# EAGLE design sensor_board (EAGLE 7.2.0)
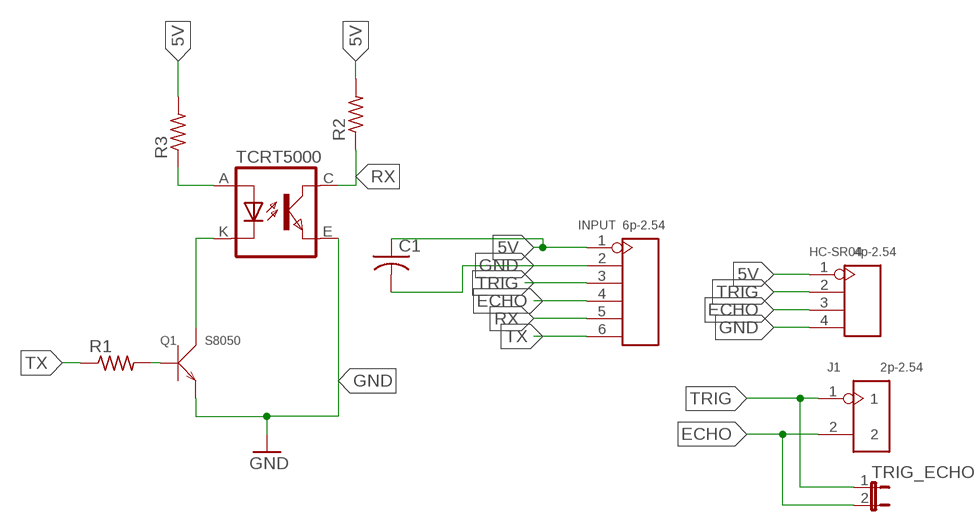
[diagram p0: schematic, sheet 1]

## Parts
C1  C-USC1206  [C1206]
HC-SR04  4p-2.54  DIP-BLACK-FEMALE-HEADER-VERT(4P-2.54)  [H4-2.54]
INPUT  6p-2.54  DIP-BLACK-FEMALE-HEADER-VERT(6P-2.54)  [H6-2.54]
J1  2p-2.54  DIP-BLACK-MALE-HEADER-VERT(2P-2.54)  [H2-2.54]
Q1  S8050  SMD-TRANSISTORS-NPN-25V-500MW-S8050(SOT-23)  [SOT-23]
R1  R-US_R1206  [R1206]
R2  R-US_R1206  [R1206]
R3  R-US_R1206  [R1206]
TCRT5000  TCRT5000  [TCRT5000]
TRIG_ECHO  JUMPER-2SMD-NC  [SJ_2S]

## Nets
5V: C1.1 HC-SR04.1 INPUT.1 R2.2 R3.2
ECHO: HC-SR04.3 INPUT.4 J1.2 TRIG_ECHO.2
GND: C1.2 HC-SR04.4 INPUT.2 Q1.2(E) TCRT5000.E(EMITTER)
N$3: R3.1 TCRT5000.A(ANODE)
N$6: Q1.3(C) TCRT5000.K(CATHODE)
N$7: Q1.1(B) R1.2
RX: INPUT.5 R2.1 TCRT5000.C(COLLECTOR)
TRIG: HC-SR04.2 INPUT.3 J1.1 TRIG_ECHO.1
TX: INPUT.6 R1.1

## Library data of the parts
C1 = adafruit:C-US: CAPACITOR, American symbol
HC-SR04 = Seeed-Connector -2016:DIP-BLACK-FEMALE-HEADER-VERT(4P-2.54): 320030017; MPN: F185-1104A1BSYA1
INPUT = Seeed-Connector -2016:DIP-BLACK-FEMALE-HEADER-VERT(6P-2.54): 320030060; MPN: F185-1106A1BSYC1
J1 = Seeed-Connector -2016:DIP-BLACK-MALE-HEADER-VERT(2P-2.54): 320020016; MPN: P125-1102A0BS116A1
Q1 = Seeed-Transistor-2016:SMD-TRANSISTORS-NPN-25V-500MW-S8050(SOT-23): 305010017; MPN: S8050
R1-R3 = adafruit:R-US_: RESISTOR, American symbol
TCRT5000 = tcrt5000:TCRT5000
TRIG_ECHO = SparkFun-Retired:JUMPER-2: Jumper Basic 0.1" spaced jumper. Use with breakaway headers.

## Board
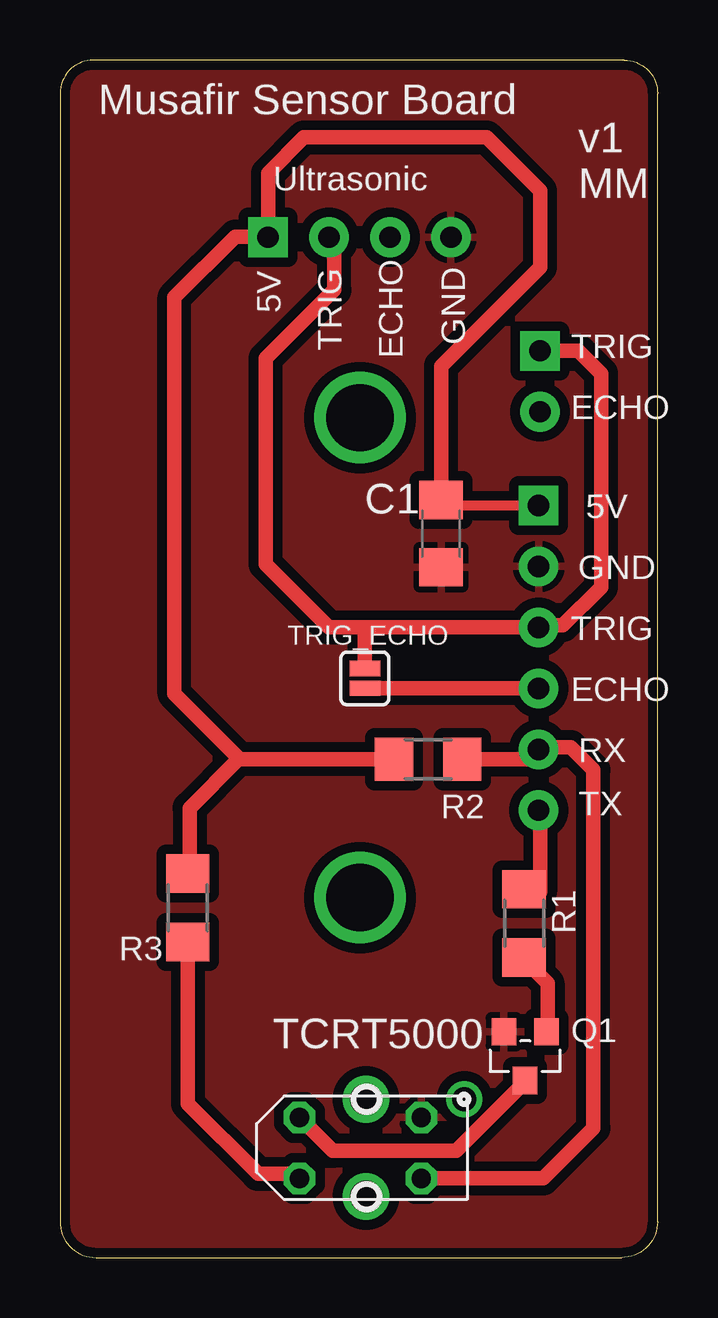
[diagram p1: board, top side]
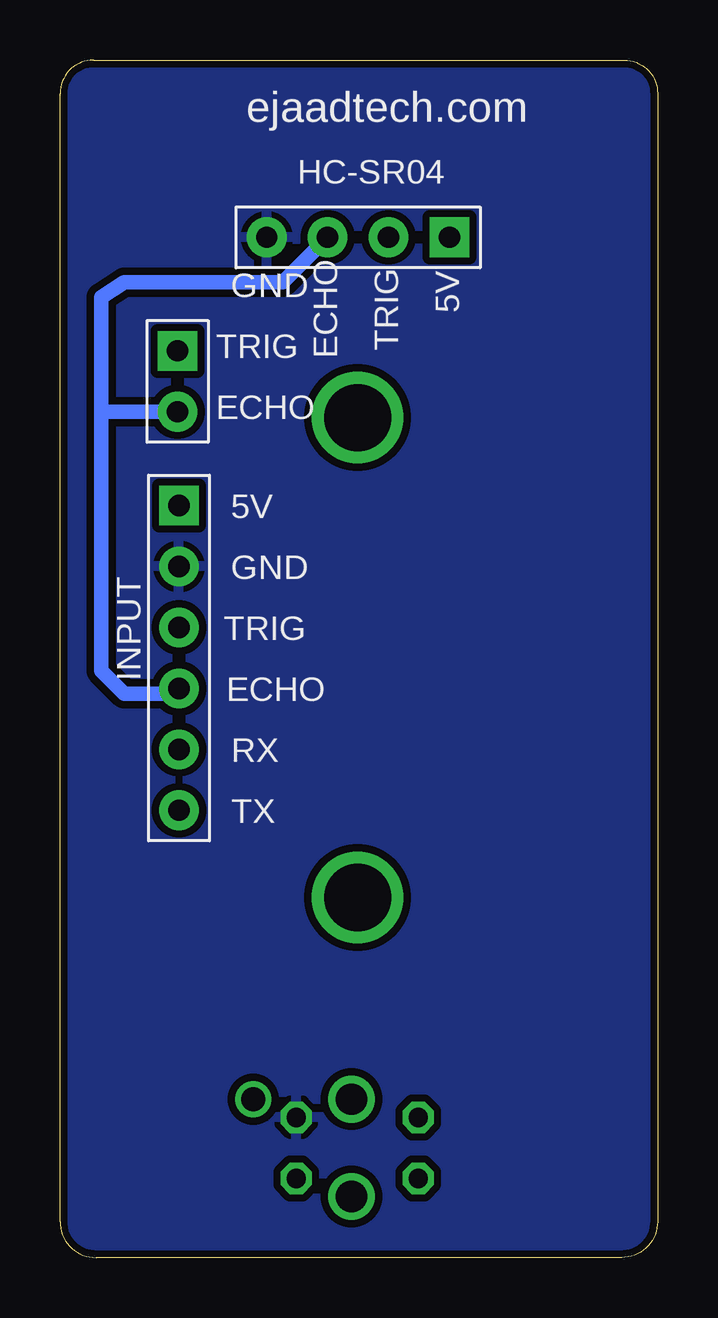
[diagram p2: board, bottom side, seen from below]

Size 24.9 x 49.9 mm. Coordinates in mm from the lower left corner, seen from the top.
Outline: 1.5,0 23.4,0 arc90 24.9,1.5 24.9,48.5 arc90 23.5,49.9 1.4,49.9 arc90 0,48.5 0,1.5 arc90 1.5,0
Copper layers (1*16): Top 0.035mm / dielectric 1.5mm / Bottom 0.035mm
Design rules "SeeedStudio_2layer_DRU_no_angle_20140221": minimum track width 6mil, minimum drill 12mil, track to track 6mil, track to pad 6mil, pad to pad 6mil, via to via 6mil, smd to smd 0mil, copper to edge 10mil, drill to drill 10mil, minimum pad ring 10mil, minimum via ring 6mil, stop-mask expansion 2mil, vias tented up to drill 100mil, thermal gap 10mil

### Footprints (pad centres in the part's own frame; a part is rotated, then mirrored left to right if it is on the bottom)
C1206 = smd 1.6 x 1.8: 1 -1.4,0; 2 1.4,0
H4-2.54 = drill 0.889 pad 1.651 square: 1 0,3.81 | drill 0.889 pad 1.651: 2 0,1.27; 3 0,-1.27; 4 0,-3.81
H6-2.54 = drill 0.889 pad 1.651 square: 1 0,6.35 | drill 0.889 pad 1.651: 2 0,3.81; 3 0,1.27; 4 0,-1.27; 5 0,-3.81; 6 0,-6.35
H2-2.54 = drill 0.889 pad 1.651 square: 1 0,1.27 | drill 0.889 pad 1.651: 2 0,-1.27
SOT-23 = smd 1.016 x 1.143: 1 -0.889,-1.016; 2 0.889,-1.016; 3 0,1.016
R1206 = smd 1.6 x 1.803: 1 -1.422,0; 2 1.422,0
TCRT5000 = drill 0.8 octagon: A -2.54,-1.27; C 2.54,-1.27; E 2.54,1.27; K -2.54,1.27
SJ_2S = smd 0.635 x 1.27: 1 -0.412,0; 2 0.412,0

### Placement (x,y rotation side)
C1  15.88,30.16 270 top
HC-SR04  12.48,42.51 270 bottom
INPUT  19.94,24.99 0 bottom
J1  20,36.51 0 bottom
Q1  19.38,8.39 180 top
R1  19.34,13.93 270 top
R2  15.34,20.77 180 top
R3  5.33,14.58 90 top
TCRT5000  12.52,4.57 0 top
TRIG_ECHO  12.7,24.13 270 top

### Tracks (layer width: path | path; a pad name or v marks a point on that pad's centre or on a via)
5V
  Top 0.406: INPUT.1 15.88,31.34 C1.1
  Top 0.61: R3.2 5.4,16.07 5.4,18.73 7.43,20.77 R2.2 7.49,20.77 4.76,23.5 4.76,40.01 7.3,42.55 8.63,42.55 HC-SR04.1 8.67,45.18 10.16,46.67 17.78,46.67 20,44.45 20,41.27 15.88,37.15 15.88,31.34 | 20,31.4 INPUT.1
ECHO
  Top 0.61: INPUT.4 TRIG_ECHO.2 | TRIG_ECHO.2
  Bottom 0.61: 13.75,42.13 HC-SR04.3 15.62,40.64 22.23,40.64 23.18,40.01 23.18,35.24 | INPUT.4 20.16,23.5 22.23,23.5 23.18,24.45 23.18,35.24 | J1.2 23.18,35.24
GND
  pour Bottom (isolate 0.305): 0.1,49.83 24.86,49.83 24.86,49.51 25.08,0 0,0
  pour Top (isolate 0.406): -0.22,50.15 24.86,50.15 25.01,0.02 0,0.32
N$2  (via drill 2.8)
  other vias: 12.5,15
N$3
  Top 0.61: R3.1 5.33,6.42 8.26,3.49 9.78,3.49 TCRT5000.A
N$4  (via drill 2.8)
  other vias: 12.5,35
N$5  (via drill 1.3)
  other vias: 12.75,6.6
N$6
  Top 0.61: Q1.3 19.38,7.32 16.51,4.45 11.37,4.45 TCRT5000.K
N$7
  Top 0.61: R1.2 19.34,12.41 20.32,11.43 20.32,9.46 Q1.1
N$8  (via drill 1.3)
  other vias: 12.75,2.55
N$9  (via drill 1)
  other vias: 16.85,6.6
RX
  Top 0.61: TCRT5000.C 20.13,3.3 22.23,5.4 22.23,20.32 21.27,21.27 20.04,21.27 INPUT.5 19.53,20.77 R2.1
TRIG
  Top 0.61: HC-SR04.2 11.43,42.29 11.43,40.32 8.57,37.47 8.57,28.89 11.21,26.26 12.7,26.26 | 12.7,26.26 INPUT.3 20.04,26.35 20.95,26.35 22.54,27.94 22.54,36.83 21.59,37.78 J1.1 | TRIG_ECHO.1 12.7,26.26
TX
  Top 0.61: INPUT.6 20,18.64 20,15.24 19.34,15.24 R1.1

### Text on the board
tNames: Musafir Sensor Board | v1 | Ultrasonic | MM | GND | 5V | TRIG | ECHO | TRIG | ECHO | 5V | GND | TRIG | ECHO | RX | TX
bNames: ejaadtech.com | GND | 5V | TRIG | ECHO | TRIG | ECHO | 5V | GND | TRIG | ECHO | RX | TX